# Altium schematic sheet sch.SchDoc
size A2
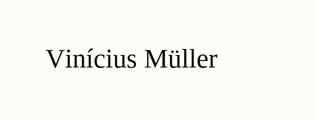
[diagram p0: sch.SchDoc]

## Notes on the sheet
- Vinícius Müller